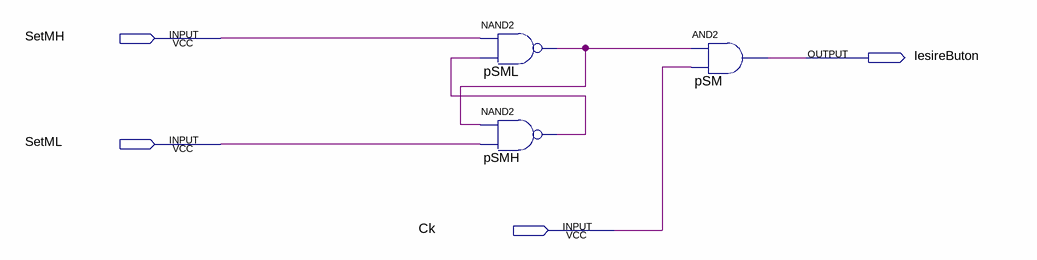
[diagram p0: schematic sheet]
// Quartus schematic Buton.bdf as structural Verilog: 3 symbols, 4 pins
module Buton (
  input  SetMH,
  input  SetML,
  input  Ck,
  output IesireButon
);

  wire pSMH_out, pSML_out;

  nand pSML (pSML_out, SetMH, pSMH_out);
  nand pSMH (pSMH_out, pSML_out, SetML);
  and pSM (IesireButon, pSML_out, Ck);
endmodule
